# Altium schematic sheet schem.SchDoc
size A; SheetNumber: 1; SheetTotal: 1
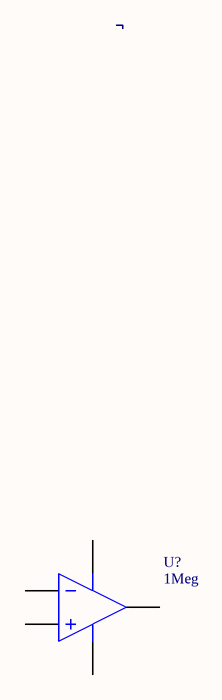
[diagram p0: schem.SchDoc]

## Parts
U?  GAIN: 1Meg  (hidden comment: Ideal Operational Amplifier)

## Nets

Not connected (* = marked no-connect by the designer): U? 1(IN-) 2(IN+) 3(OUT) 4(V+) 5(V-)

## Library data of the parts
U? = OpAmp with power terminals: SimulationGenericComponent: True